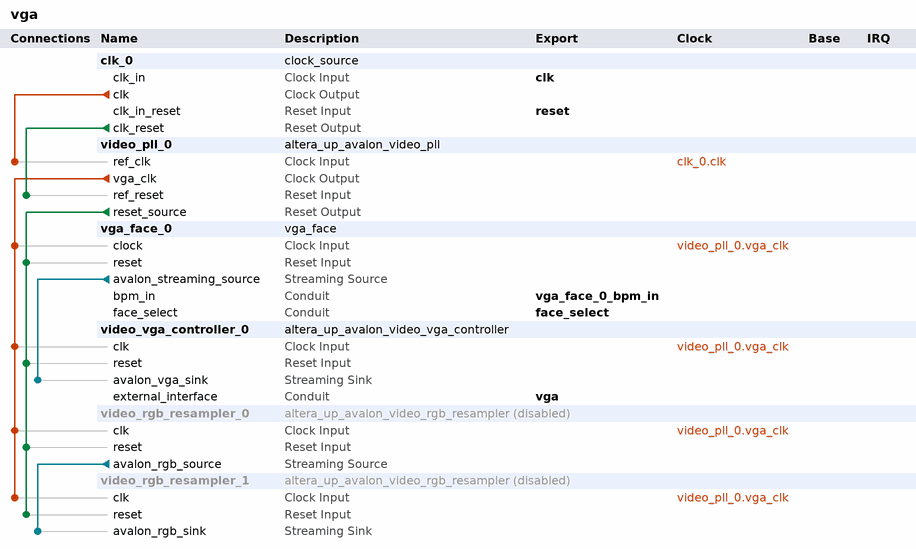
[diagram p0: system contents]
# Platform Designer (Qsys) system vga, Cyclone IV E EP4CE115F29C7
# Parameters at their usual value, and those the tool derives, are not listed.
package require -exact qsys 18.0
create_system vga
set_project_property DEVICE_FAMILY {Cyclone IV E}
set_project_property DEVICE EP4CE115F29C7

add_instance clk_0 clock_source 20.1
set_instance_parameter_value clk_0 clockFrequency 50000000

add_instance video_pll_0 altera_up_avalon_video_pll 18.0
set_instance_parameter_value video_pll_0 camera {5MP Digital Camera (THDB_D5M)}
set_instance_parameter_value video_pll_0 gui_refclk 50.0
set_instance_parameter_value video_pll_0 lcd {7" LCD on VEEK-MT and MTL/MTL2 Modules}

add_instance vga_face_0 vga_face 1.0

add_instance video_vga_controller_0 altera_up_avalon_video_vga_controller 18.0
set_instance_parameter_value video_vga_controller_0 board DE2-115
set_instance_parameter_value video_vga_controller_0 resolution {VGA 640x480}

add_instance video_rgb_resampler_0 altera_up_avalon_video_rgb_resampler 18.0
set_instance_property video_rgb_resampler_0 ENABLED false
set_instance_parameter_value video_rgb_resampler_0 alpha 1023
set_instance_parameter_value video_rgb_resampler_0 input_type {30-bit RGB}
set_instance_parameter_value video_rgb_resampler_0 output_type {8-bit Grayscale}

add_instance video_rgb_resampler_1 altera_up_avalon_video_rgb_resampler 18.0
set_instance_property video_rgb_resampler_1 ENABLED false
set_instance_parameter_value video_rgb_resampler_1 alpha 1023
set_instance_parameter_value video_rgb_resampler_1 input_type {8-bit Grayscale}
set_instance_parameter_value video_rgb_resampler_1 output_type {30-bit RGB}

# connections
add_connection clk_0.clk video_pll_0.ref_clk clock
add_connection video_pll_0.vga_clk vga_face_0.clock clock
add_connection video_pll_0.vga_clk video_rgb_resampler_0.clk clock
add_connection video_pll_0.vga_clk video_rgb_resampler_1.clk clock
add_connection video_pll_0.vga_clk video_vga_controller_0.clk clock
add_connection clk_0.clk_reset video_pll_0.ref_reset reset
add_connection video_pll_0.reset_source vga_face_0.reset reset
add_connection video_pll_0.reset_source video_rgb_resampler_0.reset reset
add_connection video_pll_0.reset_source video_rgb_resampler_1.reset reset
add_connection video_pll_0.reset_source video_vga_controller_0.reset reset
add_connection vga_face_0.avalon_streaming_source video_vga_controller_0.avalon_vga_sink avalon_streaming
add_connection video_rgb_resampler_0.avalon_rgb_source video_rgb_resampler_1.avalon_rgb_sink avalon_streaming

# exported interfaces
add_interface clk clock sink
set_interface_property clk EXPORT_OF clk_0.clk_in
add_interface face_select conduit end
set_interface_property face_select EXPORT_OF vga_face_0.face_select
add_interface reset reset sink
set_interface_property reset EXPORT_OF clk_0.clk_in_reset
add_interface vga conduit end
set_interface_property vga EXPORT_OF video_vga_controller_0.external_interface
add_interface vga_face_0_bpm_in conduit end
set_interface_property vga_face_0_bpm_in EXPORT_OF vga_face_0.bpm_in

set_interconnect_requirement {$system} qsys_mm.clockCrossingAdapter HANDSHAKE
set_interconnect_requirement {$system} qsys_mm.enableEccProtection FALSE
set_interconnect_requirement {$system} qsys_mm.insertDefaultSlave FALSE
set_interconnect_requirement {$system} qsys_mm.maxAdditionalLatency 1

save_system vga.qsys
